# EasyEDA schematic SCH_BatteryProtection-Circuit-copy_2026-05-02.json
TITLE: Sheet_1; REV: 1.0; Date: 2025-08-19; Sheet: 1/1; Drawn By: rahber; Company: Your Company
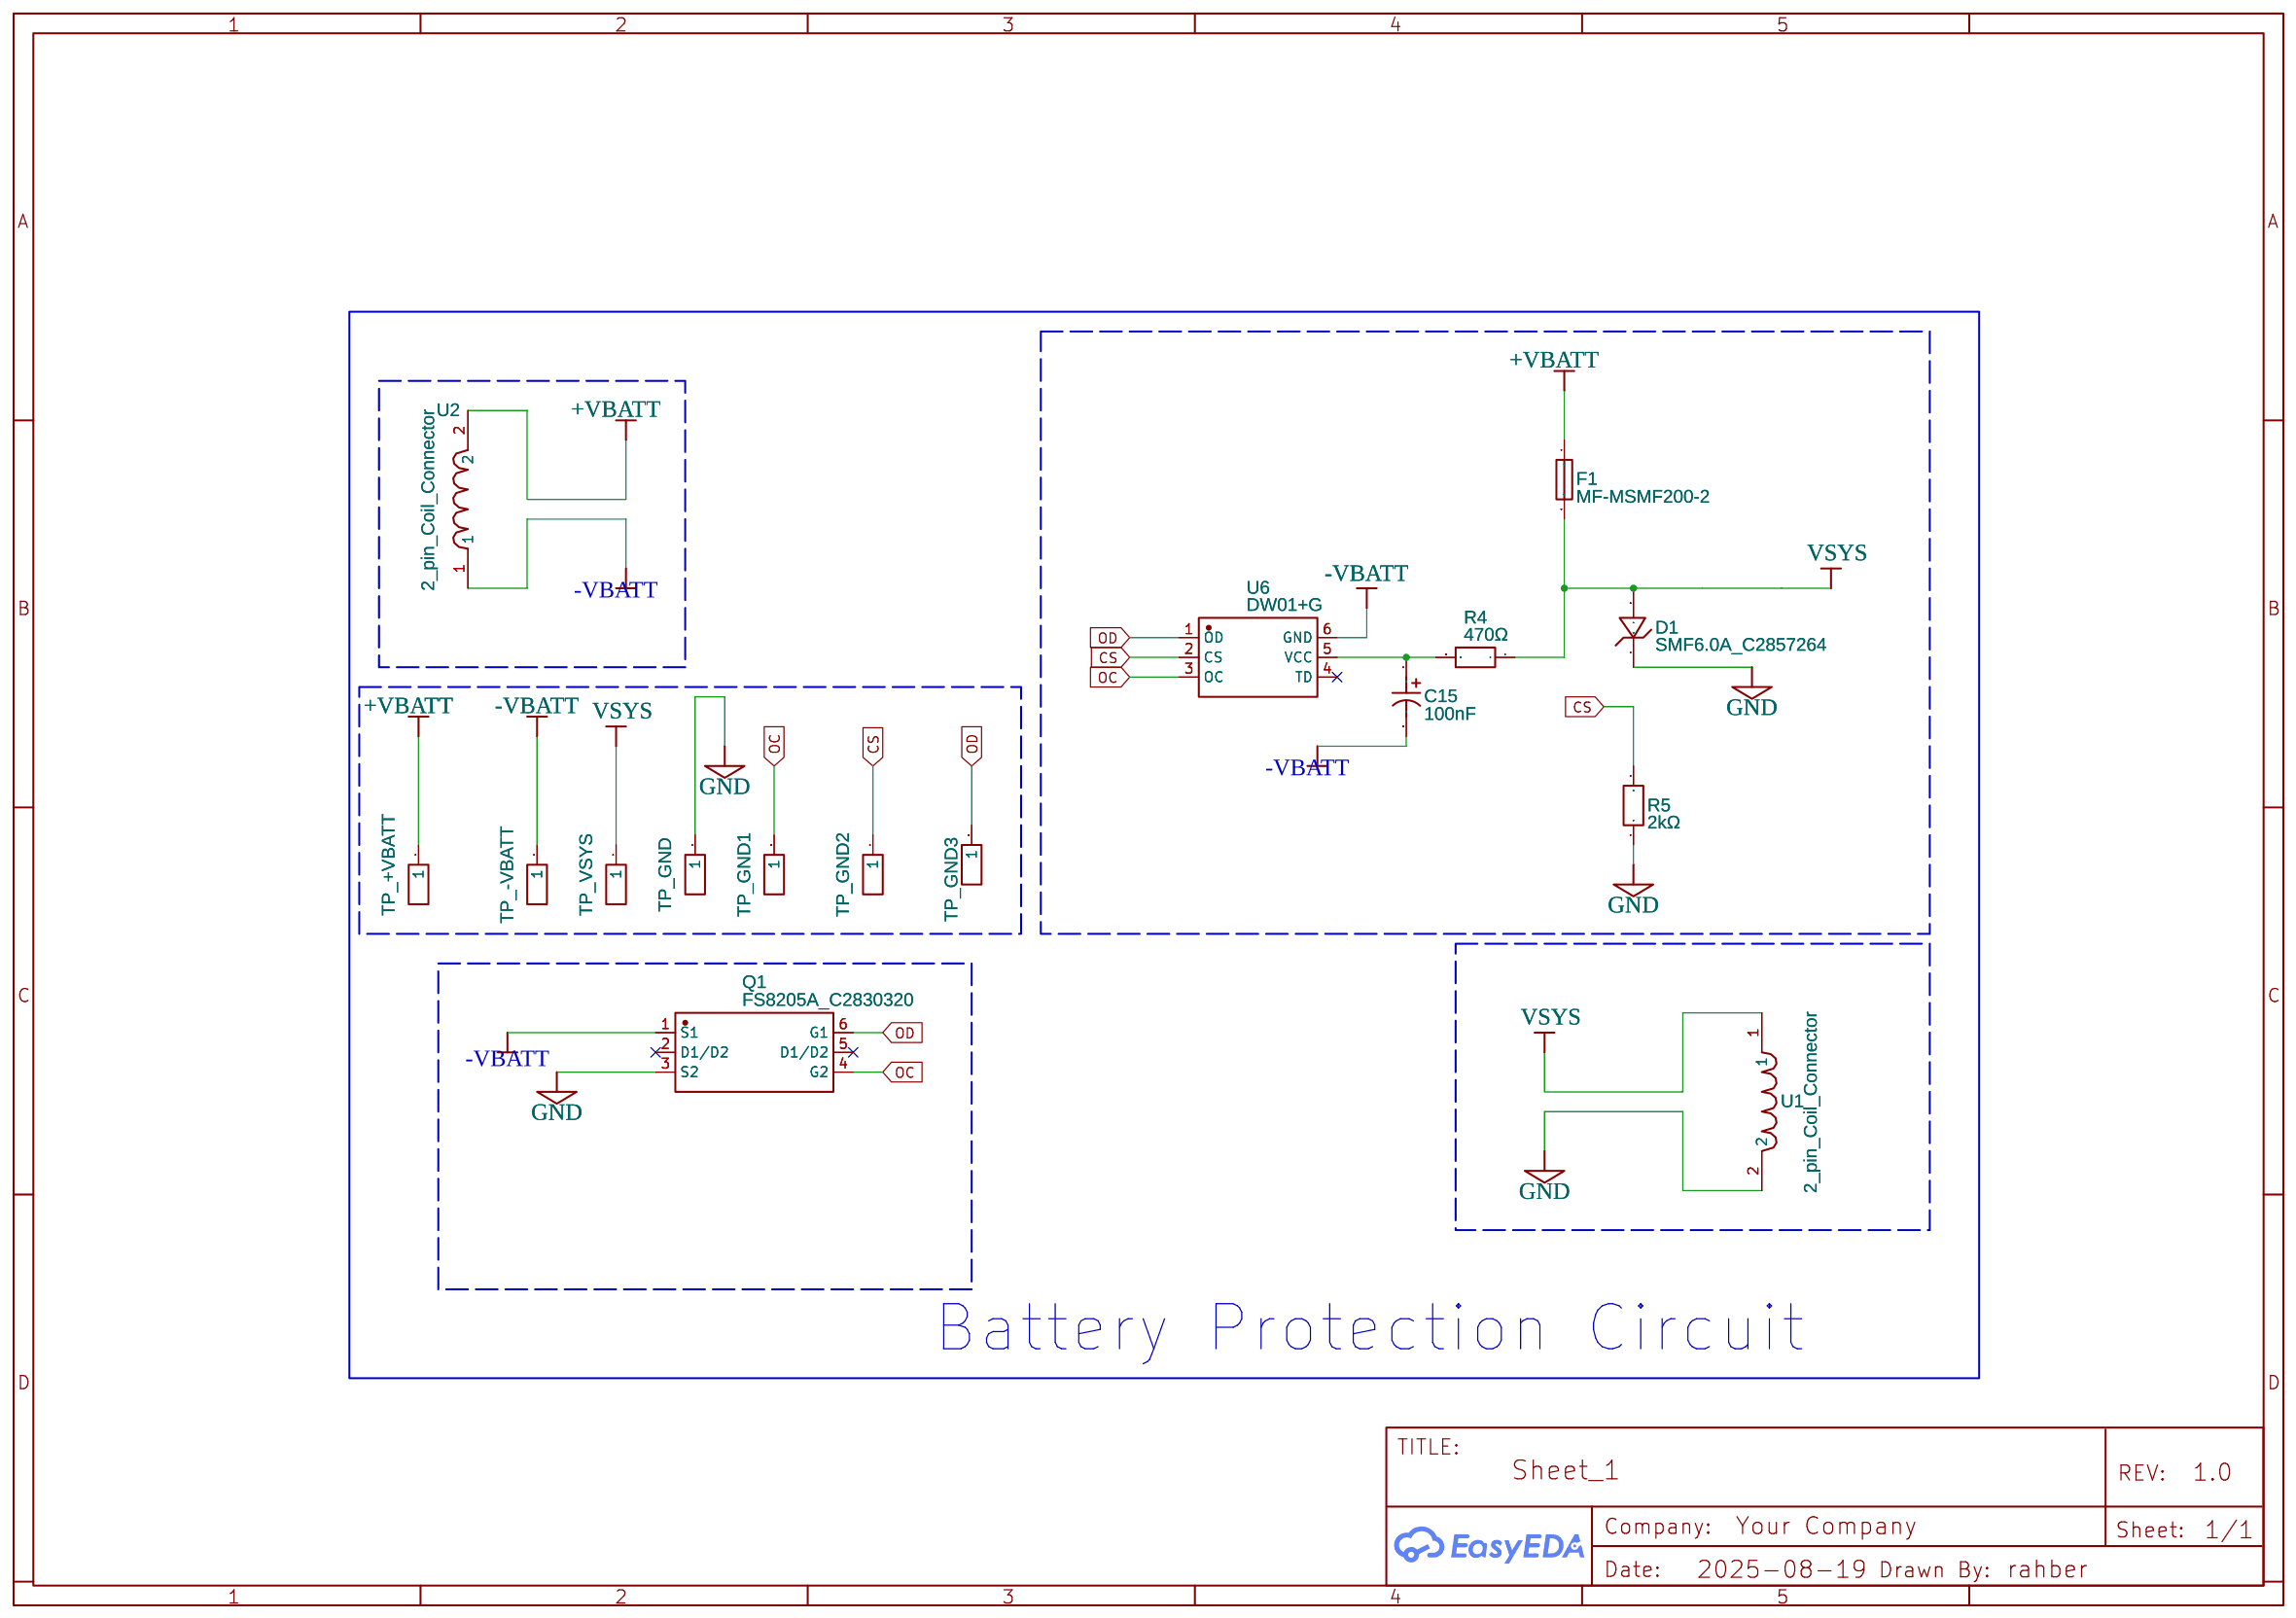
[diagram p0: schematic sheet]

## Parts
C15  100nF  [CAP-SMD_BD4.0-L4.3-W4.3-LS5.0-FD]
D1  SMF6.0A_C2857264  [SOD-123FL_L2.8-W1.9-LS3.7-RD]
F1  MF-MSMF200-2  [F1812]
Q1  FS8205A_C2830320  [SOT-23-6_L2.9-W1.6-P0.95-LS2.8-BR]
R4  470Ω  [R0805]
R5  2kΩ  [R0805]
TP_+VBATT  HDR-M-2.54_1x1  [HDR-M-2.54_1X1]
TP_-VBATT  HDR-M-2.54_1x1  [HDR-M-2.54_1X1]
TP_GND  HDR-M-2.54_1x1  [HDR-M-2.54_1X1]
TP_GND1  HDR-M-2.54_1x1  [HDR-M-2.54_1X1]
TP_GND2  HDR-M-2.54_1x1  [HDR-M-2.54_1X1]
TP_GND3  HDR-M-2.54_1x1  [HDR-M-2.54_1X1]
TP_VSYS  HDR-M-2.54_1x1  [HDR-M-2.54_1X1]
U1  2_pin_Coil_Connector  [2_PIN_COIL_CONNECTOR_UPDATED]
U2  2_pin_Coil_Connector  [2_PIN_COIL_CONNECTOR_UPDATED]
U6  DW01+G  [SOT-23-6_L2.9-W1.6-P0.95-LS2.8-BR]

## Library data of the parts
C15 = 225RV0060: Supplier: LCSC; Supplier Part: C46682882; Manufacturer: KNSCHA(科尼盛); Contributor: lcsc
D1 = SMF6.0A_C2857264: Contributor: LCSC; Supplier: LCSC; Supplier Part: C2857264; Manufacturer: JSMSEMI(杰盛微); Manufacturer Part: SMF6.0A; JLCPCB Part Class: Extended Part
F1 = MF-MSMF200-2: Contributor: LCSC; Supplier: LCSC; Supplier Part: C210837; Manufacturer: BOURNS; JLCPCB Part Class: Extended Part
Q1 = FS8205A_C2830320: Contributor: LCSC; Supplier: LCSC; Supplier Part: C2830320; Manufacturer: TECH PUBLIC(台舟); Manufacturer Part: FS8205A; JLCPCB Part Class: Extended Part
R4 = TC0525B4700T5G: Supplier: LCSC; Supplier Part: C21571494; Manufacturer: UNI-ROYAL(厚声); JLCPCB Part Class: Extended Part; Contributor: lcsc
R5 = TC0525B2001T5G: Supplier: LCSC; Supplier Part: C2988894; Manufacturer: UNI-ROYAL(厚声); JLCPCB Part Class: Extended Part; Contributor: lcsc
TP_+VBATT TP_-VBATT TP_GND TP_GND1-TP_GND3 TP_VSYS = HDR-M-2.54_1x1: Supplier Part: C81276; Supplier: LCSC; Contributor: LCEDA_Lib
U1 U2 = 2_pin_Coil_Connector: Manufacturer: WURTH ELEKTRONIK; Manufacturer Part: 760308101141; Supplier: Element14; Supplier Part: 2842208; link: https://my.element14.com/wurth-elektronik/760308101141/charging-coil-8uh-10/dp/2842208; Contributor: rahber
U6 = DW01+G: Supplier: LCSC; Manufacturer: FORTUNE(富晶); Supplier Part: C14213; JLCPCB Part Class: Extended Part

## Nets
+VBATT: F1.1 TP_+VBATT.1 U2.2
-VBATT: C15.2 Q1.1(S1) TP_-VBATT.1 U2.1 U6.6(GND)
GND: D1.1(C) Q1.3(S2) R5.1 TP_GND.1 U1.2
CS: R5.2 TP_GND2.1 U6.2(CS)
OC: Q1.4(G2) TP_GND1.1 U6.3(OC)
OD: Q1.6(G1) TP_GND3.1 U6.1(OD)
VSYS: D1.2(A) F1.2 R4.1 TP_VSYS.1 U1.1
Net-(C15-1): C15.1 R4.2 U6.5(VCC)

Not connected (* = marked no-connect by the designer): Q1 2(D1/D2)* 5(D1/D2)*; U6 4(TD)*

## Notes on the sheet
- Battery Protection Circuit
